# Altium schematic sheet rtm-top.SchDoc: Top Schematic
size A3; DocumentNumber: 1; SheetNumber: 1; SheetTotal: 9
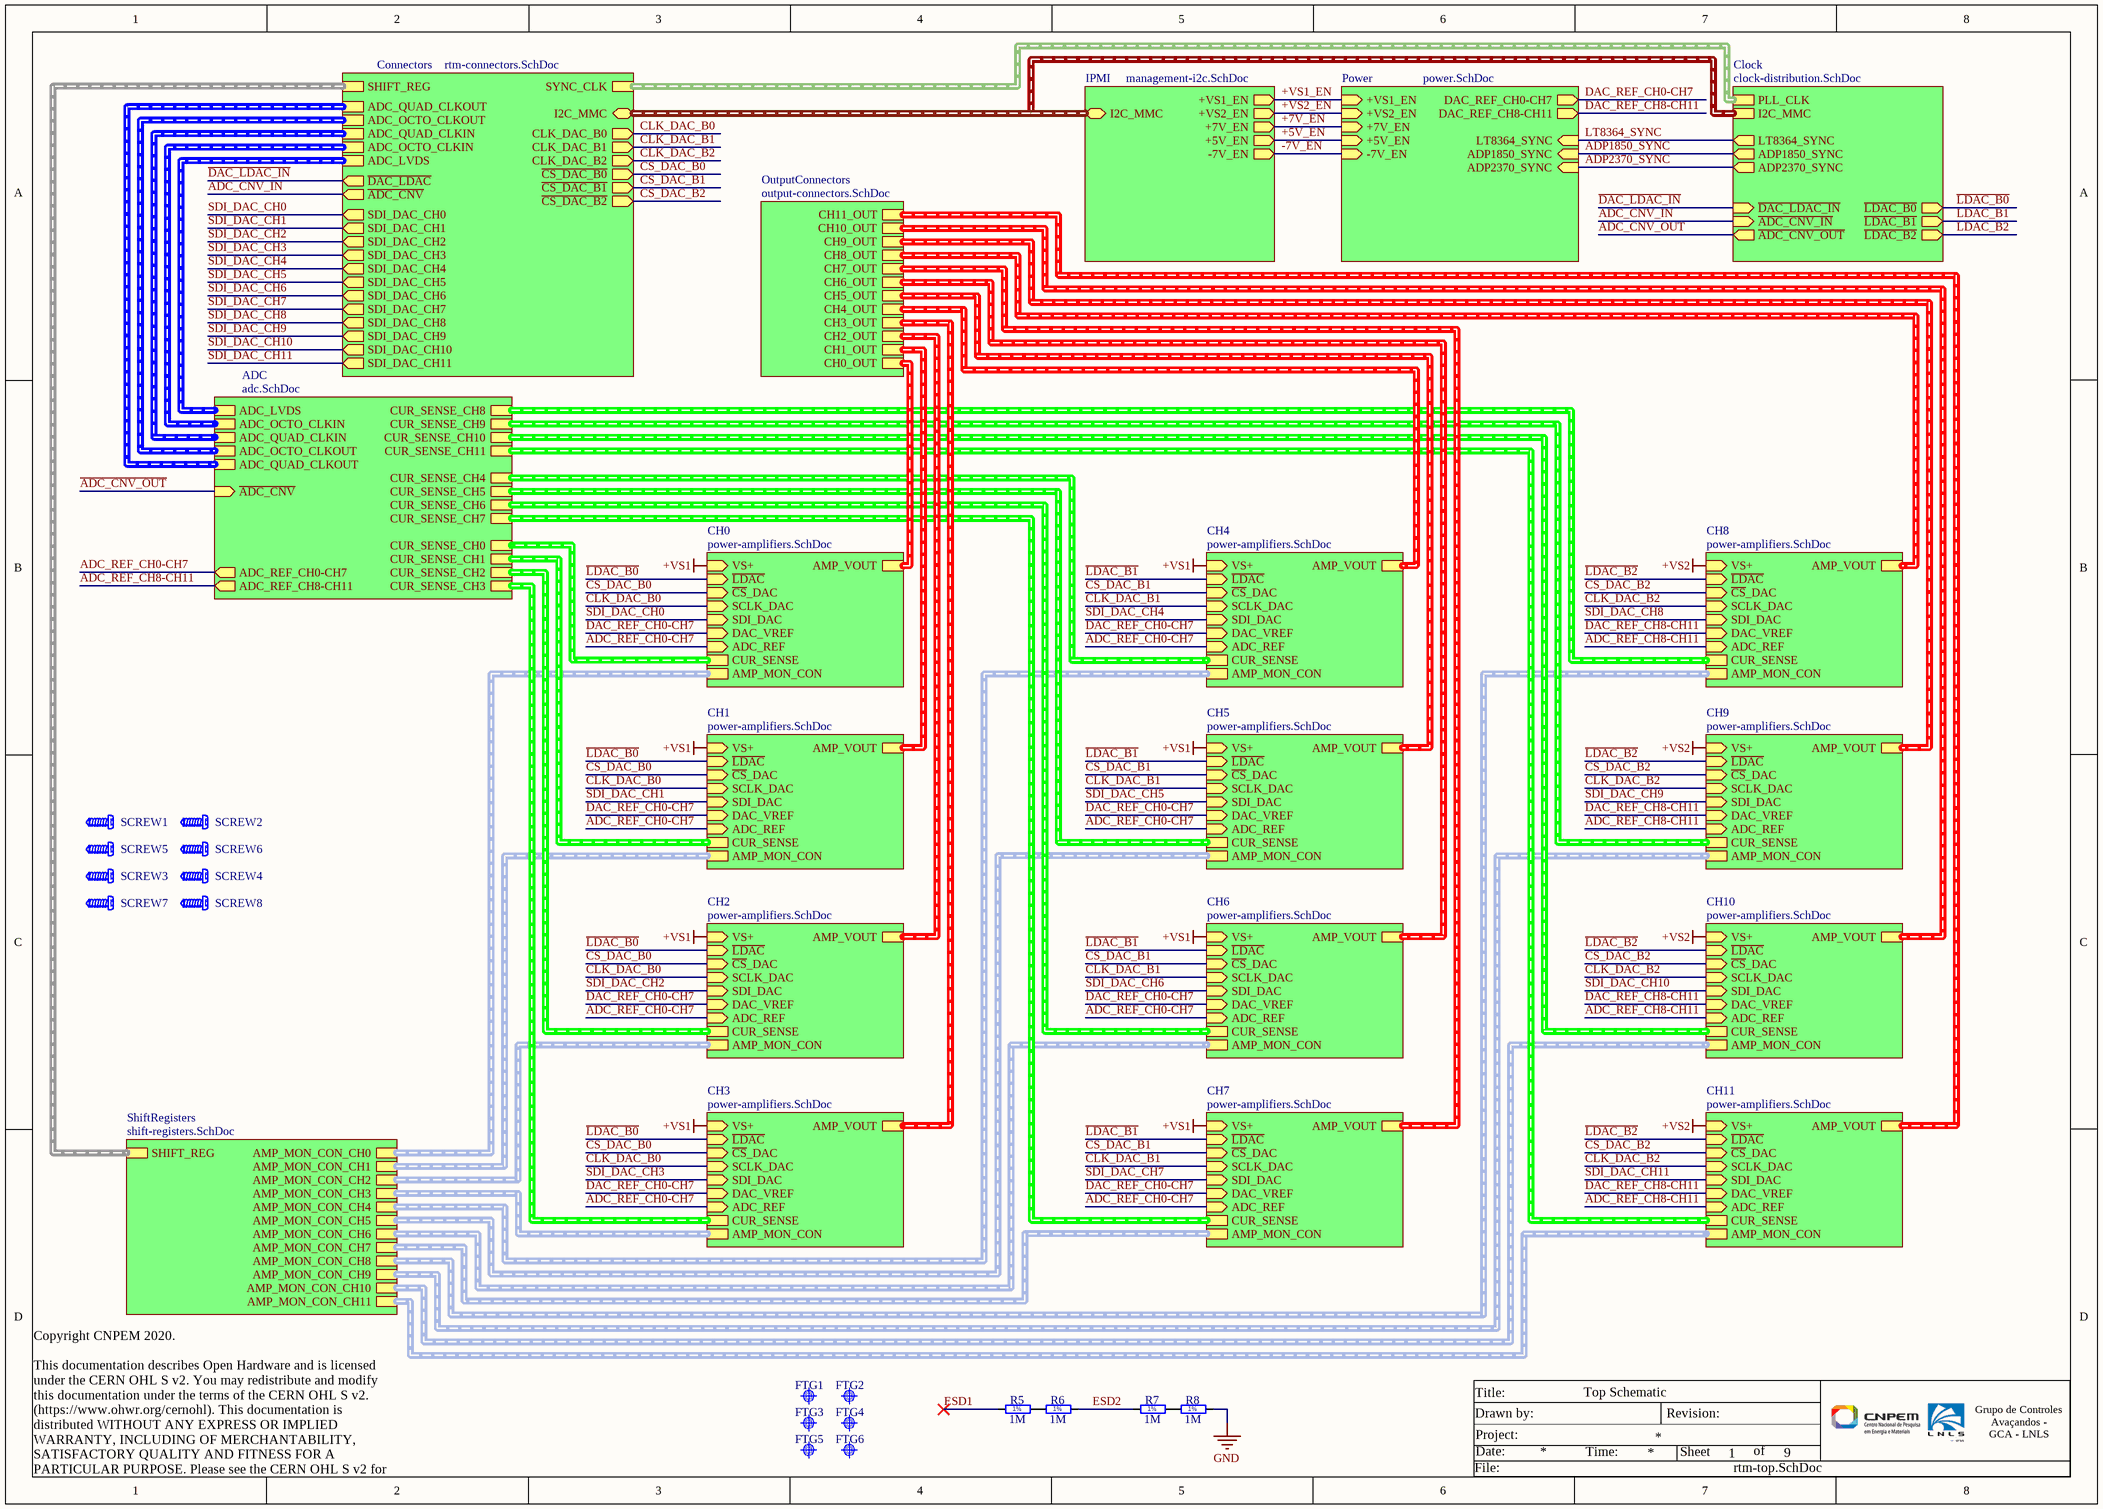
[diagram p0: rtm-top.SchDoc]

## Parts
FTG1  Use only in PCB  [FIDUCIAL_TOP_C100-200]  (value not drawn)
FTG2  Use only in PCB  [FIDUCIAL_TOP_C100-200]  (value not drawn)
FTG3  Use only in PCB  [FIDUCIAL_TOP_C100-200]  (value not drawn)
FTG4  Use only in PCB  [FIDUCIAL_TOP_C100-200]  (value not drawn)
FTG5  Use only in PCB  [FIDUCIAL_TOP_C100-200]  (value not drawn)
FTG6  Use only in PCB  [FIDUCIAL_TOP_C100-200]  (value not drawn)
R5  1M  [RESC3216X65N]
R6  1M  [RESC3216X65N]
R7  1M  [RESC3216X65N]
R8  1M  [RESC3216X65N]
SCREW1  M2x6  [MCMASTERCARR_90910A922_V]  (value not drawn)
SCREW2  M2x6  [MCMASTERCARR_90910A922_V]  (value not drawn)
SCREW3  M2x6  [MCMASTERCARR_90910A922_V]  (value not drawn)
SCREW4  M2x6  [MCMASTERCARR_90910A922_V]  (value not drawn)
SCREW5  M2x6  [MCMASTERCARR_90910A922_V]  (value not drawn)
SCREW6  M2x6  [MCMASTERCARR_90910A922_V]  (value not drawn)
SCREW7  M2x6  [MCMASTERCARR_90910A922_V]  (value not drawn)
SCREW8  M2x6  [MCMASTERCARR_90910A922_V]  (value not drawn)

## Sub-sheets
ADC = adc.SchDoc: ADC_LVDS (harness ADC_LVDS), CUR_SENSE_CH0 (harness CUR_SENSE), CUR_SENSE_CH1 (harness CUR_SENSE), CUR_SENSE_CH2 (harness CUR_SENSE), CUR_SENSE_CH3 (harness CUR_SENSE), CUR_SENSE_CH4 (harness CUR_SENSE), CUR_SENSE_CH5 (harness CUR_SENSE), CUR_SENSE_CH6 (harness CUR_SENSE), CUR_SENSE_CH7 (harness CUR_SENSE), ADC_REF_CH0-CH7 (out), CUR_SENSE_CH8 (harness CUR_SENSE), CUR_SENSE_CH9 (harness CUR_SENSE), CUR_SENSE_CH10 (harness CUR_SENSE), CUR_SENSE_CH11 (harness CUR_SENSE), ADC_REF_CH8-CH11 (out), ADC_OCTO_CLKOUT (harness ADC_CLKOUT), ADC_QUAD_CLKOUT (harness ADC_CLKOUT), ADC_OCTO_CLKIN (harness ADC_CLKIN), ADC_QUAD_CLKIN (harness ADC_CLKIN), ~{ADC_CNV} (in)
CH0 = power-amplifiers.SchDoc: ~{LDAC} (in), ~{CS}_DAC (in), SCLK_DAC (in), SDI_DAC (in), AMP_VOUT (harness AMP_VOUT), AMP_MON_CON (harness AMP_MON_CON), CUR_SENSE (harness CUR_SENSE), ADC_REF (in), VS+ (in), DAC_VREF (in)
CH1 = power-amplifiers.SchDoc: ~{LDAC} (in), ~{CS}_DAC (in), SCLK_DAC (in), SDI_DAC (in), AMP_VOUT (harness AMP_VOUT), AMP_MON_CON (harness AMP_MON_CON), CUR_SENSE (harness CUR_SENSE), ADC_REF (in), VS+ (in), DAC_VREF (in)
CH2 = power-amplifiers.SchDoc: ~{LDAC} (in), ~{CS}_DAC (in), SCLK_DAC (in), SDI_DAC (in), AMP_VOUT (harness AMP_VOUT), AMP_MON_CON (harness AMP_MON_CON), CUR_SENSE (harness CUR_SENSE), ADC_REF (in), VS+ (in), DAC_VREF (in)
CH3 = power-amplifiers.SchDoc: ~{LDAC} (in), ~{CS}_DAC (in), SCLK_DAC (in), SDI_DAC (in), AMP_VOUT (harness AMP_VOUT), AMP_MON_CON (harness AMP_MON_CON), CUR_SENSE (harness CUR_SENSE), ADC_REF (in), VS+ (in), DAC_VREF (in)
CH4 = power-amplifiers.SchDoc: ~{LDAC} (in), ~{CS}_DAC (in), SCLK_DAC (in), SDI_DAC (in), AMP_VOUT (harness AMP_VOUT), AMP_MON_CON (harness AMP_MON_CON), CUR_SENSE (harness CUR_SENSE), ADC_REF (in), VS+ (in), DAC_VREF (in)
CH5 = power-amplifiers.SchDoc: ~{LDAC} (in), ~{CS}_DAC (in), SCLK_DAC (in), SDI_DAC (in), AMP_VOUT (harness AMP_VOUT), AMP_MON_CON (harness AMP_MON_CON), CUR_SENSE (harness CUR_SENSE), ADC_REF (in), VS+ (in), DAC_VREF (in)
CH6 = power-amplifiers.SchDoc: ~{LDAC} (in), ~{CS}_DAC (in), SCLK_DAC (in), SDI_DAC (in), AMP_VOUT (harness AMP_VOUT), AMP_MON_CON (harness AMP_MON_CON), CUR_SENSE (harness CUR_SENSE), ADC_REF (in), VS+ (in), DAC_VREF (in)
CH7 = power-amplifiers.SchDoc: ~{LDAC} (in), ~{CS}_DAC (in), SCLK_DAC (in), SDI_DAC (in), AMP_VOUT (harness AMP_VOUT), AMP_MON_CON (harness AMP_MON_CON), CUR_SENSE (harness CUR_SENSE), ADC_REF (in), VS+ (in), DAC_VREF (in)
CH8 = power-amplifiers.SchDoc: ~{LDAC} (in), ~{CS}_DAC (in), SCLK_DAC (in), SDI_DAC (in), AMP_VOUT (harness AMP_VOUT), AMP_MON_CON (harness AMP_MON_CON), CUR_SENSE (harness CUR_SENSE), ADC_REF (in), VS+ (in), DAC_VREF (in)
CH9 = power-amplifiers.SchDoc: ~{LDAC} (in), ~{CS}_DAC (in), SCLK_DAC (in), SDI_DAC (in), AMP_VOUT (harness AMP_VOUT), AMP_MON_CON (harness AMP_MON_CON), CUR_SENSE (harness CUR_SENSE), ADC_REF (in), VS+ (in), DAC_VREF (in)
CH10 = power-amplifiers.SchDoc: ~{LDAC} (in), ~{CS}_DAC (in), SCLK_DAC (in), SDI_DAC (in), AMP_VOUT (harness AMP_VOUT), AMP_MON_CON (harness AMP_MON_CON), CUR_SENSE (harness CUR_SENSE), ADC_REF (in), VS+ (in), DAC_VREF (in)
CH11 = power-amplifiers.SchDoc: ~{LDAC} (in), ~{CS}_DAC (in), SCLK_DAC (in), SDI_DAC (in), AMP_VOUT (harness AMP_VOUT), AMP_MON_CON (harness AMP_MON_CON), CUR_SENSE (harness CUR_SENSE), ADC_REF (in), VS+ (in), DAC_VREF (in)
Clock = clock-distribution.SchDoc: LT8364_SYNC (out), ADP1850_SYNC (out), ADP2370_SYNC (out), PLL_CLK (harness CLOCK_DIFF), I2C_MMC (harness I2C), ~{LDAC_B0} (out), ~{LDAC_B1} (out), ~{LDAC_B2} (out), ~{ADC_CNV_OUT} (out), ~{DAC_LDAC_IN} (in), ~{ADC_CNV_IN} (in)
Connectors = rtm-connectors.SchDoc: I2C_MMC (bidir, harness I2C), SYNC_CLK (harness CLOCK_DIFF), CLK_DAC_B1 (out), CLK_DAC_B2 (out), ~{CS_DAC_B1} (out), ~{CS_DAC_B2} (out), SDI_DAC_CH0 (out), SDI_DAC_CH1 (out), SDI_DAC_CH2 (out), SDI_DAC_CH3 (out), SDI_DAC_CH4 (out), SDI_DAC_CH5 (out), SDI_DAC_CH6 (out), SDI_DAC_CH7 (out), SDI_DAC_CH8 (out), SDI_DAC_CH9 (out), SDI_DAC_CH10 (out), SDI_DAC_CH11 (out), SHIFT_REG (harness SHIFT_REG), CLK_DAC_B0 (out), ~{CS_DAC_B0} (out), ADC_LVDS (harness ADC_LVDS), ADC_OCTO_CLKIN (harness ADC_CLKIN), ADC_QUAD_CLKIN (harness ADC_CLKIN), ADC_OCTO_CLKOUT (harness ADC_CLKOUT), ADC_QUAD_CLKOUT (harness ADC_CLKOUT), ~{DAC_LDAC} (out), ~{ADC_CNV} (out)
IPMI = management-i2c.SchDoc: I2C_MMC (bidir, harness I2C), +VS1_EN (out), +VS2_EN (out), +7V_EN (out), +5V_EN (out), -7V_EN (out)
OutputConnectors = output-connectors.SchDoc: CH11_OUT (harness AMP_VOUT), CH10_OUT (harness AMP_VOUT), CH9_OUT (harness AMP_VOUT), CH8_OUT (harness AMP_VOUT), CH7_OUT (harness AMP_VOUT), CH5_OUT (harness AMP_VOUT), CH6_OUT (harness AMP_VOUT), CH4_OUT (harness AMP_VOUT), CH3_OUT (harness AMP_VOUT), CH2_OUT (harness AMP_VOUT), CH1_OUT (harness AMP_VOUT), CH0_OUT (harness AMP_VOUT)
Power = power.SchDoc: LT8364_SYNC (in), ADP1850_SYNC (in), ADP2370_SYNC (in), +5V_EN (in), -7V_EN (in), +7V_EN (in), +VS2_EN (in), +VS1_EN (in), DAC_REF_CH0-CH7 (out), DAC_REF_CH8-CH11 (out)
ShiftRegisters = shift-registers.SchDoc: AMP_MON_CON_CH0 (harness AMP_MON_CON), AMP_MON_CON_CH1 (harness AMP_MON_CON), AMP_MON_CON_CH2 (harness AMP_MON_CON), AMP_MON_CON_CH3 (harness AMP_MON_CON), AMP_MON_CON_CH4 (harness AMP_MON_CON), AMP_MON_CON_CH5 (harness AMP_MON_CON), AMP_MON_CON_CH6 (harness AMP_MON_CON), AMP_MON_CON_CH7 (harness AMP_MON_CON), AMP_MON_CON_CH8 (harness AMP_MON_CON), AMP_MON_CON_CH9 (harness AMP_MON_CON), AMP_MON_CON_CH10 (harness AMP_MON_CON), AMP_MON_CON_CH11 (harness AMP_MON_CON), SHIFT_REG (harness SHIFT_REG)

## Nets
+VS1: sheet CH0/VS+, sheet CH1/VS+, sheet CH2/VS+, sheet CH3/VS+, sheet CH4/VS+, sheet CH5/VS+, sheet CH6/VS+, sheet CH7/VS+
+VS2: sheet CH11/VS+, sheet CH10/VS+, sheet CH9/VS+, sheet CH8/VS+
GND: R8.2
+5V_EN: sheet IPMI/+5V_EN, sheet Power/+5V_EN
+7V_EN: sheet IPMI/+7V_EN, sheet Power/+7V_EN
+VS1_EN: sheet IPMI/+VS1_EN, sheet Power/+VS1_EN
+VS2_EN: sheet IPMI/+VS2_EN, sheet Power/+VS2_EN
-7V_EN: sheet IPMI/-7V_EN, sheet Power/-7V_EN
~{ADC_CNV_IN}: sheet Connectors/~{ADC_CNV}, sheet Clock/~{ADC_CNV_IN}
~{ADC_CNV_OUT}: sheet ADC/~{ADC_CNV}, sheet Clock/~{ADC_CNV_OUT}
ADC_REF_CH0-CH7: sheet ADC/ADC_REF_CH0-CH7, sheet CH0/ADC_REF, sheet CH1/ADC_REF, sheet CH2/ADC_REF, sheet CH3/ADC_REF, sheet CH4/ADC_REF, sheet CH5/ADC_REF, sheet CH6/ADC_REF, sheet CH7/ADC_REF
ADC_REF_CH8-CH11: sheet ADC/ADC_REF_CH8-CH11, sheet CH11/ADC_REF, sheet CH10/ADC_REF, sheet CH9/ADC_REF, sheet CH8/ADC_REF
ADP1850_SYNC: sheet Power/ADP1850_SYNC, sheet Clock/ADP1850_SYNC
ADP2370_SYNC: sheet Power/ADP2370_SYNC, sheet Clock/ADP2370_SYNC
~{CS_DAC_B0}: sheet Connectors/~{CS_DAC_B0}, sheet CH0/~{CS}_DAC, sheet CH1/~{CS}_DAC, sheet CH2/~{CS}_DAC, sheet CH3/~{CS}_DAC
~{CS_DAC_B1}: sheet Connectors/~{CS_DAC_B1}, sheet CH4/~{CS}_DAC, sheet CH5/~{CS}_DAC, sheet CH6/~{CS}_DAC, sheet CH7/~{CS}_DAC
~{CS_DAC_B2}: sheet Connectors/~{CS_DAC_B2}, sheet CH11/~{CS}_DAC, sheet CH10/~{CS}_DAC, sheet CH9/~{CS}_DAC, sheet CH8/~{CS}_DAC
CLK_DAC_B0: sheet Connectors/CLK_DAC_B0, sheet CH0/SCLK_DAC, sheet CH1/SCLK_DAC, sheet CH2/SCLK_DAC, sheet CH3/SCLK_DAC
CLK_DAC_B1: sheet Connectors/CLK_DAC_B1, sheet CH4/SCLK_DAC, sheet CH5/SCLK_DAC, sheet CH6/SCLK_DAC, sheet CH7/SCLK_DAC
CLK_DAC_B2: sheet Connectors/CLK_DAC_B2, sheet CH11/SCLK_DAC, sheet CH10/SCLK_DAC, sheet CH9/SCLK_DAC, sheet CH8/SCLK_DAC
~{DAC_LDAC_IN}: sheet Connectors/~{DAC_LDAC}, sheet Clock/~{DAC_LDAC_IN}
DAC_REF_CH0-CH7: sheet Power/DAC_REF_CH0-CH7, sheet CH0/DAC_VREF, sheet CH1/DAC_VREF, sheet CH2/DAC_VREF, sheet CH3/DAC_VREF, sheet CH4/DAC_VREF, sheet CH5/DAC_VREF, sheet CH6/DAC_VREF, sheet CH7/DAC_VREF
DAC_REF_CH8-CH11: sheet Power/DAC_REF_CH8-CH11, sheet CH11/DAC_VREF, sheet CH10/DAC_VREF, sheet CH9/DAC_VREF, sheet CH8/DAC_VREF
ESD1: R5.1
ESD2: R6.2 R7.1
~{LDAC_B0}: sheet CH0/~{LDAC}, sheet CH1/~{LDAC}, sheet CH2/~{LDAC}, sheet CH3/~{LDAC}, sheet Clock/~{LDAC_B0}
~{LDAC_B1}: sheet CH4/~{LDAC}, sheet CH5/~{LDAC}, sheet CH6/~{LDAC}, sheet CH7/~{LDAC}, sheet Clock/~{LDAC_B1}
~{LDAC_B2}: sheet CH11/~{LDAC}, sheet CH10/~{LDAC}, sheet CH9/~{LDAC}, sheet CH8/~{LDAC}, sheet Clock/~{LDAC_B2}
LT8364_SYNC: sheet Power/LT8364_SYNC, sheet Clock/LT8364_SYNC
SDI_DAC_CH0: sheet Connectors/SDI_DAC_CH0, sheet CH0/SDI_DAC
SDI_DAC_CH1: sheet Connectors/SDI_DAC_CH1, sheet CH1/SDI_DAC
SDI_DAC_CH2: sheet Connectors/SDI_DAC_CH2, sheet CH2/SDI_DAC
SDI_DAC_CH3: sheet Connectors/SDI_DAC_CH3, sheet CH3/SDI_DAC
SDI_DAC_CH4: sheet Connectors/SDI_DAC_CH4, sheet CH4/SDI_DAC
SDI_DAC_CH5: sheet Connectors/SDI_DAC_CH5, sheet CH5/SDI_DAC
SDI_DAC_CH6: sheet Connectors/SDI_DAC_CH6, sheet CH6/SDI_DAC
SDI_DAC_CH7: sheet Connectors/SDI_DAC_CH7, sheet CH7/SDI_DAC
SDI_DAC_CH8: sheet Connectors/SDI_DAC_CH8, sheet CH8/SDI_DAC
SDI_DAC_CH9: sheet Connectors/SDI_DAC_CH9, sheet CH9/SDI_DAC
SDI_DAC_CH10: sheet Connectors/SDI_DAC_CH10, sheet CH10/SDI_DAC
SDI_DAC_CH11: sheet Connectors/SDI_DAC_CH11, sheet CH11/SDI_DAC
NetR5_2: R5.2 R6.1
NetR7_2: R7.2 R8.1

## Buses and harness runs
harness sheet ADC/ADC_LVDS = sheet Connectors/ADC_LVDS
harness sheet ADC/ADC_OCTO_CLKIN = sheet Connectors/ADC_OCTO_CLKIN
harness sheet ADC/ADC_OCTO_CLKOUT = sheet Connectors/ADC_OCTO_CLKOUT
harness sheet ADC/ADC_QUAD_CLKIN = sheet Connectors/ADC_QUAD_CLKIN
harness sheet ADC/ADC_QUAD_CLKOUT = sheet Connectors/ADC_QUAD_CLKOUT
harness sheet ADC/CUR_SENSE_CH0 = sheet CH0/CUR_SENSE
harness sheet ADC/CUR_SENSE_CH1 = sheet CH1/CUR_SENSE
harness sheet ADC/CUR_SENSE_CH2 = sheet CH2/CUR_SENSE
harness sheet ADC/CUR_SENSE_CH3 = sheet CH3/CUR_SENSE
harness sheet ADC/CUR_SENSE_CH4 = sheet CH4/CUR_SENSE
harness sheet ADC/CUR_SENSE_CH5 = sheet CH5/CUR_SENSE
harness sheet ADC/CUR_SENSE_CH6 = sheet CH6/CUR_SENSE
harness sheet ADC/CUR_SENSE_CH7 = sheet CH7/CUR_SENSE
harness sheet ADC/CUR_SENSE_CH8 = sheet CH8/CUR_SENSE
harness sheet ADC/CUR_SENSE_CH9 = sheet CH9/CUR_SENSE
harness sheet ADC/CUR_SENSE_CH10 = sheet CH10/CUR_SENSE
harness sheet ADC/CUR_SENSE_CH11 = sheet CH11/CUR_SENSE
harness sheet CH0/AMP_MON_CON = sheet ShiftRegisters/AMP_MON_CON_CH0
harness sheet CH0/AMP_VOUT = sheet OutputConnectors/CH0_OUT
harness sheet CH1/AMP_MON_CON = sheet ShiftRegisters/AMP_MON_CON_CH1
harness sheet CH1/AMP_VOUT = sheet OutputConnectors/CH1_OUT
harness sheet CH2/AMP_MON_CON = sheet ShiftRegisters/AMP_MON_CON_CH2
harness sheet CH2/AMP_VOUT = sheet OutputConnectors/CH2_OUT
harness sheet CH3/AMP_MON_CON = sheet ShiftRegisters/AMP_MON_CON_CH3
harness sheet CH3/AMP_VOUT = sheet OutputConnectors/CH3_OUT
harness sheet CH4/AMP_MON_CON = sheet ShiftRegisters/AMP_MON_CON_CH4
harness sheet CH4/AMP_VOUT = sheet OutputConnectors/CH4_OUT
harness sheet CH5/AMP_MON_CON = sheet ShiftRegisters/AMP_MON_CON_CH5
harness sheet CH5/AMP_VOUT = sheet OutputConnectors/CH5_OUT
harness sheet CH6/AMP_MON_CON = sheet ShiftRegisters/AMP_MON_CON_CH6
harness sheet CH6/AMP_VOUT = sheet OutputConnectors/CH6_OUT
harness sheet CH7/AMP_MON_CON = sheet ShiftRegisters/AMP_MON_CON_CH7
harness sheet CH7/AMP_VOUT = sheet OutputConnectors/CH7_OUT
harness sheet CH8/AMP_MON_CON = sheet ShiftRegisters/AMP_MON_CON_CH8
harness sheet CH8/AMP_VOUT = sheet OutputConnectors/CH8_OUT
harness sheet CH9/AMP_MON_CON = sheet ShiftRegisters/AMP_MON_CON_CH9
harness sheet CH9/AMP_VOUT = sheet OutputConnectors/CH9_OUT
harness sheet CH10/AMP_MON_CON = sheet ShiftRegisters/AMP_MON_CON_CH10
harness sheet CH10/AMP_VOUT = sheet OutputConnectors/CH10_OUT
harness sheet CH11/AMP_MON_CON = sheet ShiftRegisters/AMP_MON_CON_CH11
harness sheet CH11/AMP_VOUT = sheet OutputConnectors/CH11_OUT
harness sheet Clock/I2C_MMC = sheet Connectors/I2C_MMC = sheet IPMI/I2C_MMC
harness sheet Clock/PLL_CLK = sheet Connectors/SYNC_CLK
harness sheet Connectors/SHIFT_REG = sheet ShiftRegisters/SHIFT_REG

## Notes on the sheet
- Title:
- Date:
- Project:
- Drawn by:
- Time:
- Revision:
- Sheet
- of
- Grupo de Controles Avaçandos -
  GCA - LNLS
- Copyright CNPEM 2020.
  This documentation describes Open Hardware and is licensed under the CERN OHL S v2. You may redistribute and modify this documentation under the terms of the CERN OHL S v2. (https://www.ohwr.org/cernohl). This documentation is distributed WITHOUT ANY EXPRESS OR IMPLIED WARRANTY, INCLUDING OF MERCHANTABILITY, SATISFACTORY QUALITY AND FITNESS FOR A PARTICULAR PURPOSE. Please see the CERN OHL S v2 for applicable conditions.
- File:
- (in symbol R1206_1M_1%_0.25W_100PPM) 1%

## Library data of the parts
FTG1-FTG6 = FIDUCIAL_TARGET_C100-200: Round Fiducial Target, Top Layer, 1.0mm, Top Solder 2.0mm, Keepout =2.0mm; Mounted: No; Part Number: FIDUCIAL_TARGET_C100-200; Component Kind: Standard (No BOM); Component Type: Standard (No BOM); Pin Count: 1; Family: Fiducial; Socket: No; SMD: Yes; Sense: No; Status: None; ComponentHeight: 0mm; HelpURL: Undefined; Author: CERN DEM JLC; CreateDate: 09/02/2010; LatestRevisionDate: 04/04/2012; PackageDescription: Round Fiducial Target, Top Layer, 1.0mm, Top Solder 2.0mm, Keepout =2.0mm
R5-R8 = R1206_1M_1%_0.25W_100PPM: General Purpose Thick Film Chip Resistor; Manufacturer: GENERIC; Manufacturer1 Part Number: NRC12F1004TRF; Power: 0.25W; TC: ±100ppm/°C; Tolerance: ±1%; Part Number: R1206_1M_1%_0.25W_100PPM; Component Kind: Standard; Component Type: Standard; Pin Count: 2; Value: 1M; Status: Preferred; Manufacturer Part Number: R1206_1M_1%_0.25W_100PPM; Case: 1206; Mounted: Yes; Sense: No; Socket: No; SMD: Yes; Manufacturer1 Example: NIC COMPONENT; Manufacturer1 ComponentHeight: 0.65mm; HelpURL: \\cern.ch\dfs\Applications\Altium\Datasheets\R1206_NIC_NRC.pdf; Author: CERN DEM JLC; CreateDate: 03/12/2007; LatestRevisionDate: 13/03/2008
SCREW1-SCREW8 = MCMASTERCARR_90910A922_v: M2 L=6mm Torx Socket Pan Head Screw, Fully Threaded - Stainless Steel; Manufacturer: MCMASTER-CARR; PressFit: No; Part Number: MCMASTERCARR_90910A922_v; Component Kind: Standard; Component Type: Mechanical; Pin Count: 0; PackageDescription: M2 L=6mm Hexalobular Socket Pan Head Screw, Fully Threaded - Stainless Steel; Mounted: Yes; Socket: No; SMD: No; Sense: No; Status: None; Value: M2x6; Manufacturer Part Number: 90910A922; ComponentHeight: 7.1mm; Author: LNLS DIG AFG; CreateDate: 05/08/2020; LatestRevisionDate: 05/08/2020